# Altium schematic sheet 05_Connector.SchDoc
size A4; SheetNumber: 5; SheetTotal: 5
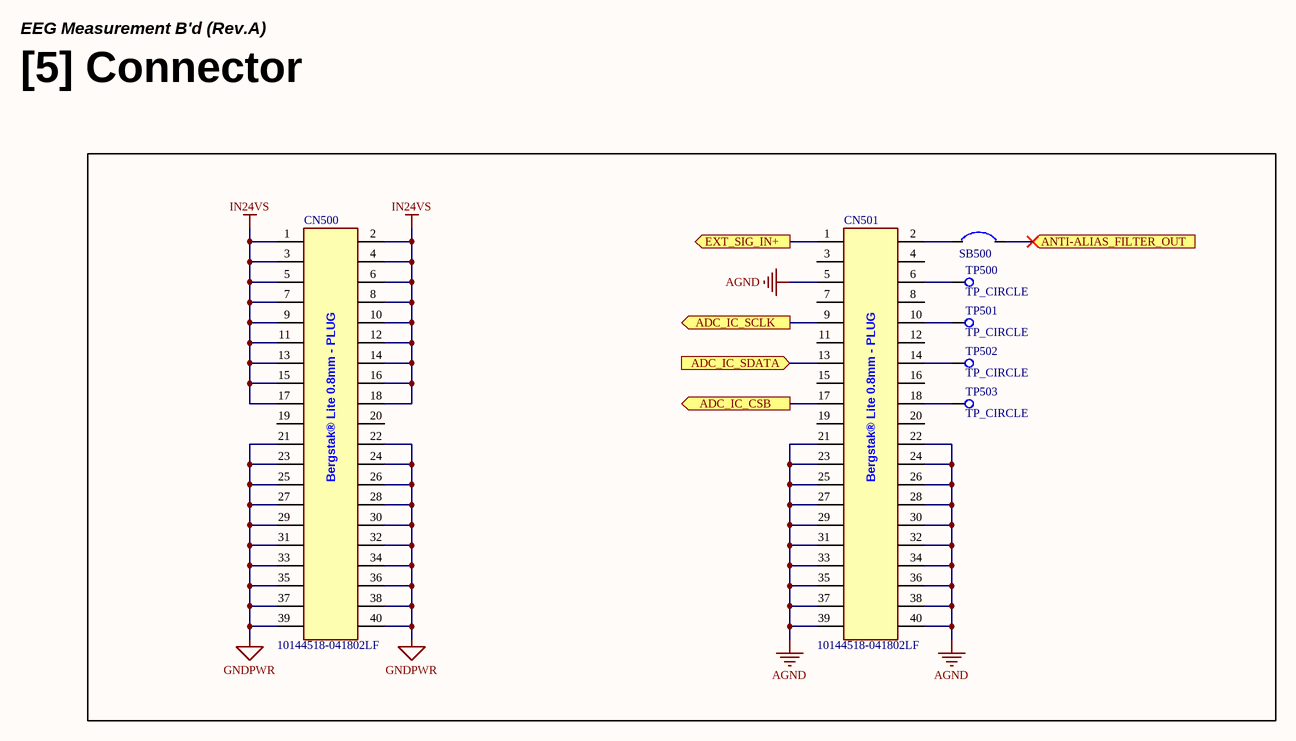
[diagram p0: 05_Connector.SchDoc]

## Parts
CN500  10144518-041802LF  [CON_BergStak-Lite(0.8mm)_PLUG-40P(10144518-041802LF)]
CN501  10144518-041802LF  [CON_BergStak-Lite(0.8mm)_PLUG-40P(10144518-041802LF)]
SB500  SB  [SB (Solder-Bridge)]  (value not drawn)
TP500  TP_CIRCLE  [TP Circle]
TP501  TP_CIRCLE  [TP Circle]
TP502  TP_CIRCLE  [TP Circle]
TP503  TP_CIRCLE  [TP Circle]

## Ports
ADC_IC_CSB (out), ADC_IC_SCLK (out), ADC_IC_SDATA (in), ANTI-ALIAS_FILTER_OUT (in), EXT_SIG_IN+ (out)

## Nets
AGND: CN501.5 CN501.21 CN501.22 CN501.23 CN501.24 CN501.25 CN501.26 CN501.27 CN501.28 CN501.29 CN501.30 CN501.31 CN501.32 CN501.33 CN501.34 CN501.35 CN501.36 CN501.37 CN501.38 CN501.39 CN501.40
GNDPWR: CN500.21 CN500.22 CN500.23 CN500.24 CN500.25 CN500.26 CN500.27 CN500.28 CN500.29 CN500.30 CN500.31 CN500.32 CN500.33 CN500.34 CN500.35 CN500.36 CN500.37 CN500.38 CN500.39 CN500.40
IN24VS: CN500.1 CN500.2 CN500.3 CN500.4 CN500.5 CN500.6 CN500.7 CN500.8 CN500.9 CN500.10 CN500.11 CN500.12 CN500.13 CN500.14 CN500.15 CN500.16 CN500.17 CN500.18
ADC_IC_CSB: CN501.17 ; port ADC_IC_CSB
ADC_IC_SCLK: CN501.9 ; port ADC_IC_SCLK
ADC_IC_SDATA: CN501.13 ; port ADC_IC_SDATA
ANTI-ALIAS_FILTER_OUT: SB500.2 ; port ANTI-ALIAS_FILTER_OUT
EXT_SIG_IN+: CN501.1 ; port EXT_SIG_IN+
NetCN501_2: CN501.2 SB500.1
NetCN501_6: CN501.6 TP500.1(TP)
NetCN501_10: CN501.10 TP501.1(TP)
NetCN501_14: CN501.14 TP502.1(TP)
NetCN501_18: CN501.18 TP503.1(TP)

Not connected (* = marked no-connect by the designer): CN500 19 20; CN501 3 4 7 8 11 12 15 16 19 20

## Notes on the sheet
- EEG Measurement B'd (Rev.A)
- [5] Connector
- Title
- Rev
- Doc
- Sheet #
- of
- Author
- This document is copyright of ArkX and shall not be revealed, produced, copied, in whole or in part,
- Date
- nor used for any purpose other than submitted.
- (in symbol CON_BergStak-Lite(0.8mm)_PLUG-40P(10144518-041802LF)) Bergstak® Lite 0.8mm - PLUG

## Library data of the parts
CN500 CN501 = CON_BergStak-Lite(0.8mm)_PLUG-40P(10144518-041802LF): LCSC Part #: C5410298; JLCPCB Part Type: Extended Part
SB500 = SB_Solder-Bridge